# Altium schematic sheet INT_REG.SchDoc
size A; SheetNumber: 3; SheetTotal: 5
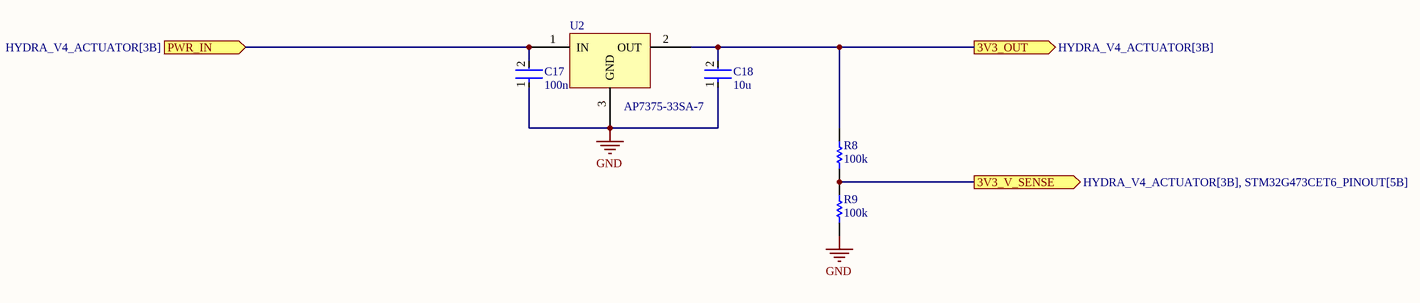
[diagram p0: INT_REG.SchDoc]

## Parts
C17  100n  [FP-0402-L_1_0_0_05-W_0_5-IPC_A]
C18  10u  [FP-0402-L_1_0_0_05-W_0_5-IPC_A]
R8  100k  [R0603B]
R9  100k  [R0603B]
U2  AP7375-33SA-7  [SOT90P285X110-3N]

## Ports
3V3_OUT (out, see HYDRA_V4_ACTUATOR[3B]), 3V3_V_SENSE (out, see HYDRA_V4_ACTUATOR[3B], STM32G473CET6_PINOUT[5B]), PWR_IN (in, see HYDRA_V4_ACTUATOR[3B])

## Nets
GND: C17.1 C18.1 R9.1 U2.3(GND)
3V3_OUT: C18.2 R8.2 U2.2(OUT) ; port 3V3_OUT
3V3_V_SENSE: R8.1 R9.2 ; port 3V3_V_SENSE
PWR_IN: C17.2 U2.1(IN) ; port PWR_IN

## Library data of the parts
C17 C18 = CMP-001-00058-1: LARGE PADS, 0402 CAP, CHANGE COMMENT TO MATCH REAL P/N; Capacitor Type: Ceramic; Min Operating Temperature: -55°C; Mounting Technology: Surface Mount; Pins: 2; Case/Package: 0402; RoHS Compliant: Yes; Max Operating Temperature: 85°C
R8 R9 = CMP-009-00002-14: Resistor
U2 = CMP-019-00039-1: LDO Regulator Pos 3.3V 0.3A 3-Pin SOT-23 T/R